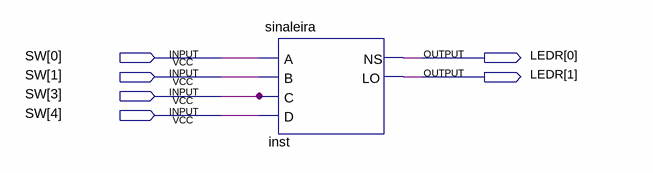
[diagram p0: schematic sheet]
// Quartus schematic semaforo.bdf as structural Verilog: 1 symbols, 6 pins
module semaforo (
  input  [4:0] SW,
  output [1:0] LEDR
);

  sinaleira inst (.A(SW[0]), .B(SW[1]), .C(SW[3]), .D(SW[4]), .NS(LEDR[0]), .LO(LEDR[1]));
endmodule
